# Altium schematic sheet Power Switch.SchDoc
size 297 x 209 mm; SheetNumber: 12; SheetTotal: 29
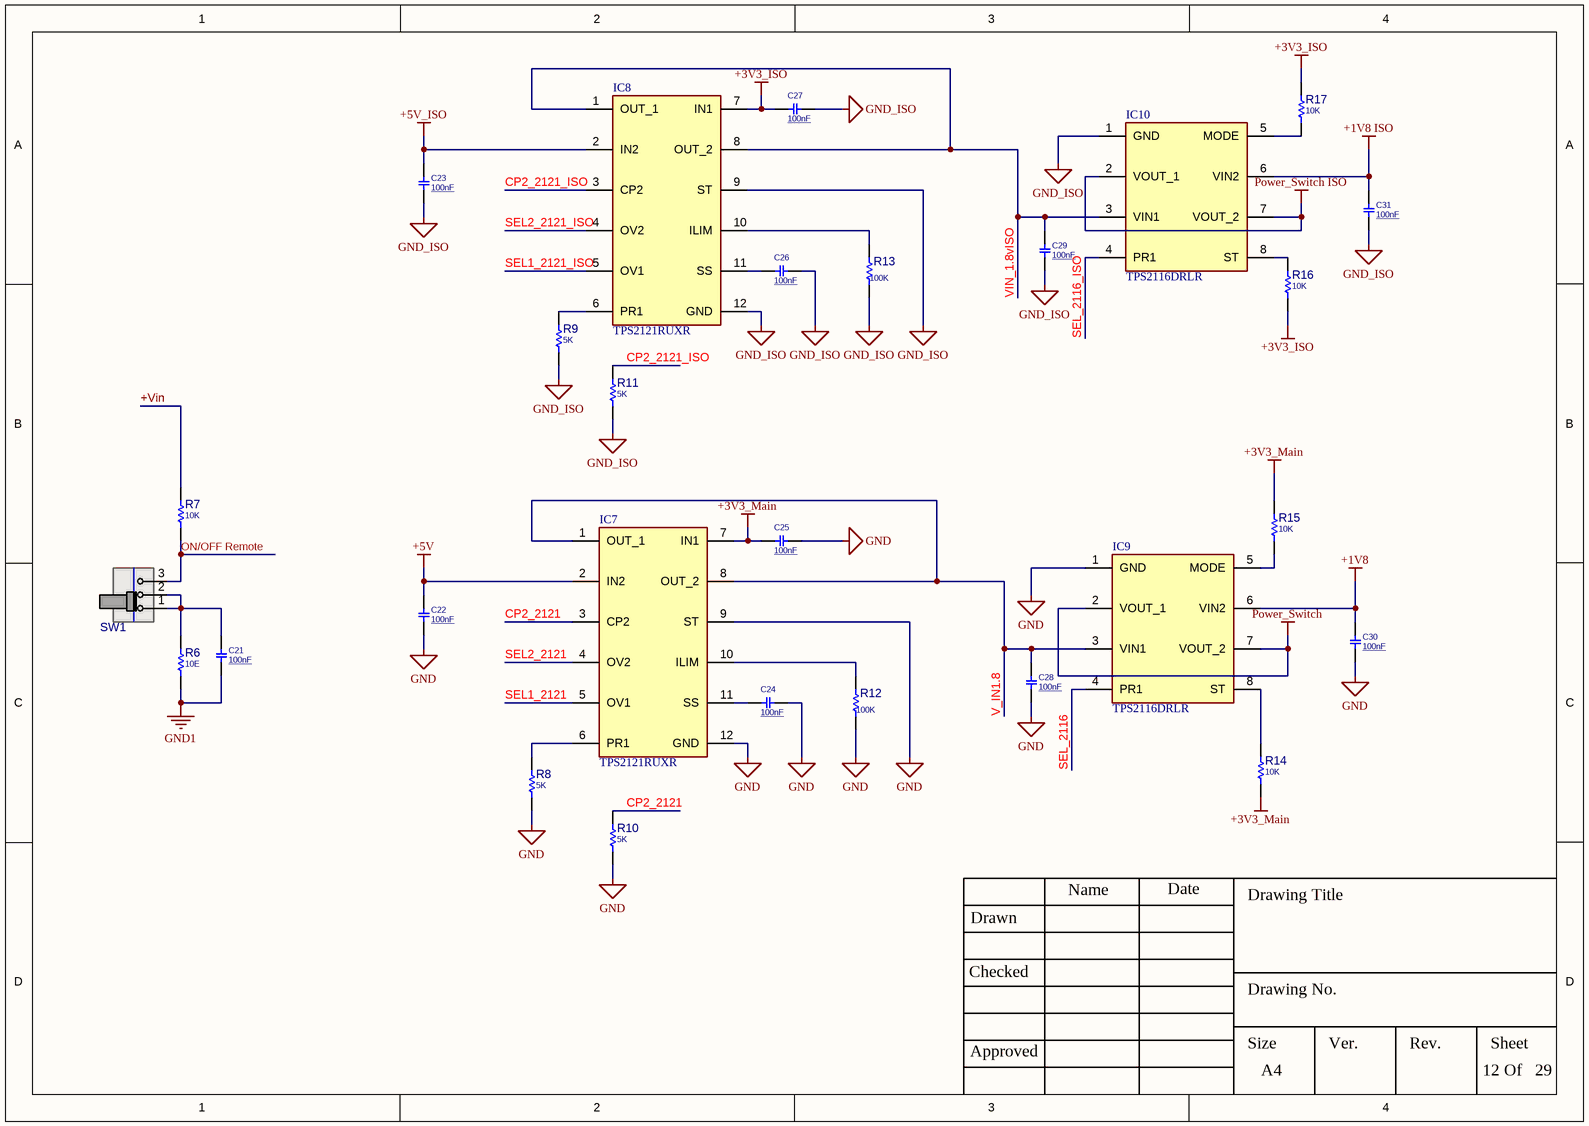
[diagram p0: Power Switch.SchDoc]

## Parts
C21  100nF  [C1206]
C22  100nF  [C0603]
C23  100nF  [C0603]
C24  100nF  [C0603]
C25  100nF  [C0603]
C26  100nF  [C0603]
C27  100nF  [C0603]
C28  100nF  [C0603]
C29  100nF  [C0603]
C30  100nF  [C0603]
C31  100nF  [C0603]
IC7  TPS2121RUXR  [TPS2121RUXR]
IC8  TPS2121RUXR  [TPS2121RUXR]
IC9  TPS2116DRLR  [SOTFL50P160X60-8N]
IC10  TPS2116DRLR  [SOTFL50P160X60-8N]
R6  10E  [R0603]
R7  10K  [R1206]
R8  5K  [R0603]
R9  5K  [R0603]
R10  5K  [R0603]
R11  5K  [R0603]
R12  value 100K  [R0603]  (hidden comment: 0R)
R13  value 100K  [R0603]  (hidden comment: 10K)
R14  10K  [R0603]
R15  10K  [R0603]
R16  10K  [R0603]
R17  10K  [R0603]
SW1  SlideSwitch  [SWSLIDT_SPDT_R_8X4]  (value not drawn)

## Nets
+1V8: C30.1 IC9.6(VIN2)
+1V8 ISO: C31.1 IC10.6(VIN2)
+3V3_ISO: C27.1 IC8.7(IN1) R16.2 R17.2
+3V3_Main: C25.1 IC7.7(IN1) R14.2 R15.2
+5V: C22.1 IC7.2(IN2)
+5V_ISO: C23.1 IC8.2(IN2)
GND: C22.2 C24.1 C25.2 C28.2 C30.2 IC7.9(ST) IC7.12(GND) IC9.1(GND) R8.1 R10.1 R12.1
GND1: C21.1 R6.1
GND_ISO: C23.2 C26.1 C27.2 C29.2 C31.2 IC8.9(ST) IC8.12(GND) IC10.1(GND) R9.1 R11.1 R13.1
Power_Switch: IC9.2(VOUT_1) IC9.7(VOUT_2)
Power_Switch ISO: IC10.2(VOUT_1) IC10.7(VOUT_2)
+Vin: R7.1
CP2_2121: IC7.3(CP2) R10.2
CP2_2121_ISO: IC8.3(CP2) R11.2
ON/OFF Remote: R7.2 SW1.3(P4)
SEL1_2121: IC7.5(OV1)
SEL1_2121_ISO: IC8.5(OV1)
SEL2_2121: IC7.4(OV2)
SEL2_2121_ISO: IC8.4(OV2)
SEL_2116: IC9.4(PR1)
SEL_2116_ISO: IC10.4(PR1)
V_IN1.8: C28.1 IC7.1(OUT_1) IC7.8(OUT_2) IC9.3(VIN1)
VIN_1.8vISO: C29.1 IC8.1(OUT_1) IC8.8(OUT_2) IC10.3(VIN1)
NetC21_2: C21.2 R6.2 SW1.1(P1) SW1.2(P3)
NetC24_2: C24.2 IC7.11(SS)
NetC26_2: C26.2 IC8.11(SS)
NetIC7_6: IC7.6(PR1) R8.2
NetIC7_10: IC7.10(ILIM) R12.2
NetIC8_6: IC8.6(PR1) R9.2
NetIC8_10: IC8.10(ILIM) R13.2
NetIC9_5: IC9.5(MODE) R15.1
NetIC9_8: IC9.8(ST) R14.1
NetIC10_5: IC10.5(MODE) R17.1
NetIC10_8: IC10.8(ST) R16.1

## Notes on the sheet
- Drawn
- Name
- Date
- Drawing Title
- Checked
- Drawing No.
- Approved
- Size
- A4
- Ver.
- Rev.
- Sheet
- Of

## Library data of the parts
C21 = CAP_SMD_MLCC_1206: CAP, MLCC, -F, -V, MATERIAL, -%, 0201; PARAM: -, -%; MANF_P#: MANF_PART#; PRICE: 100= 1$; MANF: -; PARAM2: -V; ASSEMBLY: ASSEMBLY; VALUE: 100nF
C22-C31 = CAP_SMD_MLCC_0603: CAP, MLCC, -F, -V, MATERIAL, -%, 0201; PARAM: -, -%; MANF_P#: MANF_PART#; PRICE: 100= 1$; MANF: -; PARAM2: -V; ASSEMBLY: ASSEMBLY; VALUE: 100nF
IC7 IC8 = TPS2121RUXR: Integrated Circuit; Manufacturer_Name: Texas Instruments; Datasheet Link: https://www.ti.com/lit/gpn/TPS2121; Height: 1mm; Manufacturer_Part_Number: TPS2121RUXR; Mouser Part Number: 595-TPS2121RUXR; Mouser Price/Stock: https://www.mouser.co.uk/ProductDetail/Texas-Instruments/TPS2121RUXR?qs=qSfuJ%252Bfl%2Fd7dCYiVnUfngQ%3D%3D; Arrow Part Number: TPS2121RUXR; Arrow Price/Stock: null?utm_currency=USD&region=nac
IC9 IC10 = TPS2116DRLR: Integrated Circuit; Manufacturer_Name: Texas Instruments; Datasheet Link: https://www.ti.com/lit/gpn/tps2116; Height: 0.6mm; Manufacturer_Part_Number: TPS2116DRLR; Mouser Part Number: 595-TPS2116DRLR; Mouser Price/Stock: https://www.mouser.co.uk/ProductDetail/Texas-Instruments/TPS2116DRLR?qs=aP1CjGhiNiGo3XAyXcVPaQ%3D%3D; Arrow Part Number: TPS2116DRLR; Arrow Price/Stock: https://www.arrow.com/en/products/tps2116drlr/texas-instruments?region=nac
R6 R8-R17 = RES_SMD_0603: RESISTOR, SMD; PARAM: -W; DESC: DESCRIPTION; DIST#: MOUSER; PARAM2: 1%; MANF_P#: -; MANF: -; ASSEMBLY: ASSEMBLY; PRICE: 100= 0.5$
  R6: VALUE: 10E
  R8-R11: VALUE: 5K
  R14-R17: VALUE: 10K
R7 = RES_SMD_1206: RESISTOR, SMD; PARAM: -W; DESC: DESCRIPTION; DIST#: MOUSER; PARAM2: 1%; MANF_P#: -; MANF: -; ASSEMBLY: ASSEMBLY; PRICE: 100= 0.5$; VALUE: 10K
SW1 = SWSLIDT_SPDT_R_8X4: SWITCH, SLIDE, SPDT, 8X4mm, THD; MANF_PART#: MHSS1105; MANF: Apem; DESC: DESCRIPTION; VALUE: SlideSwitch; ASSEMBLY: ASSEMBLY; PARAM: PARAM; PRICE: 0.5$